# Altium schematic sheet Private_CPU_Power.SchDoc
size D
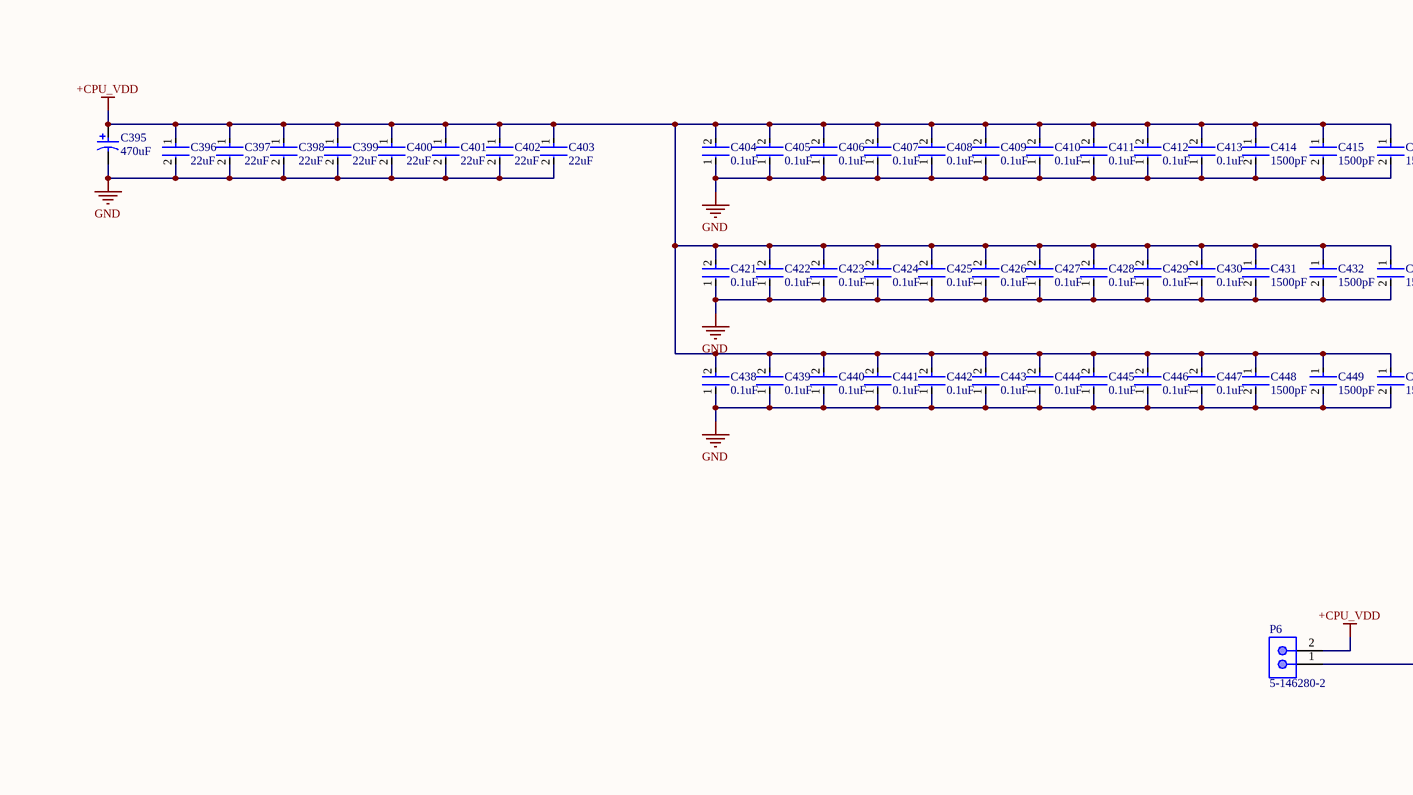
[diagram p0: Private_CPU_Power.SchDoc, top left]
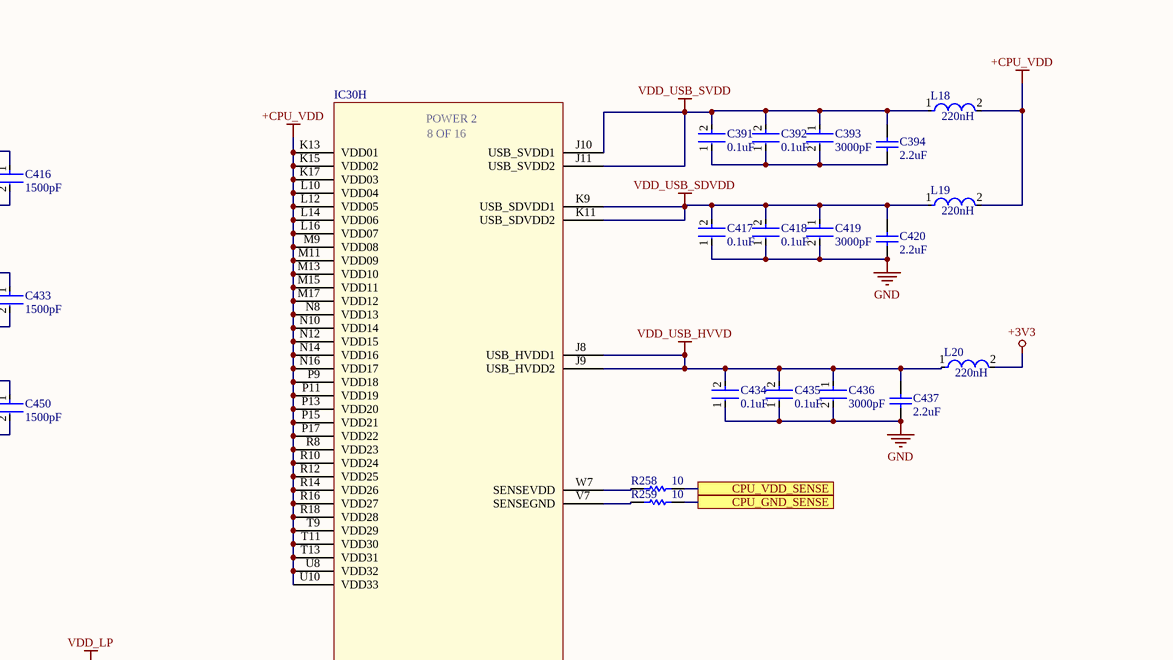
[diagram p1: Private_CPU_Power.SchDoc, top right]
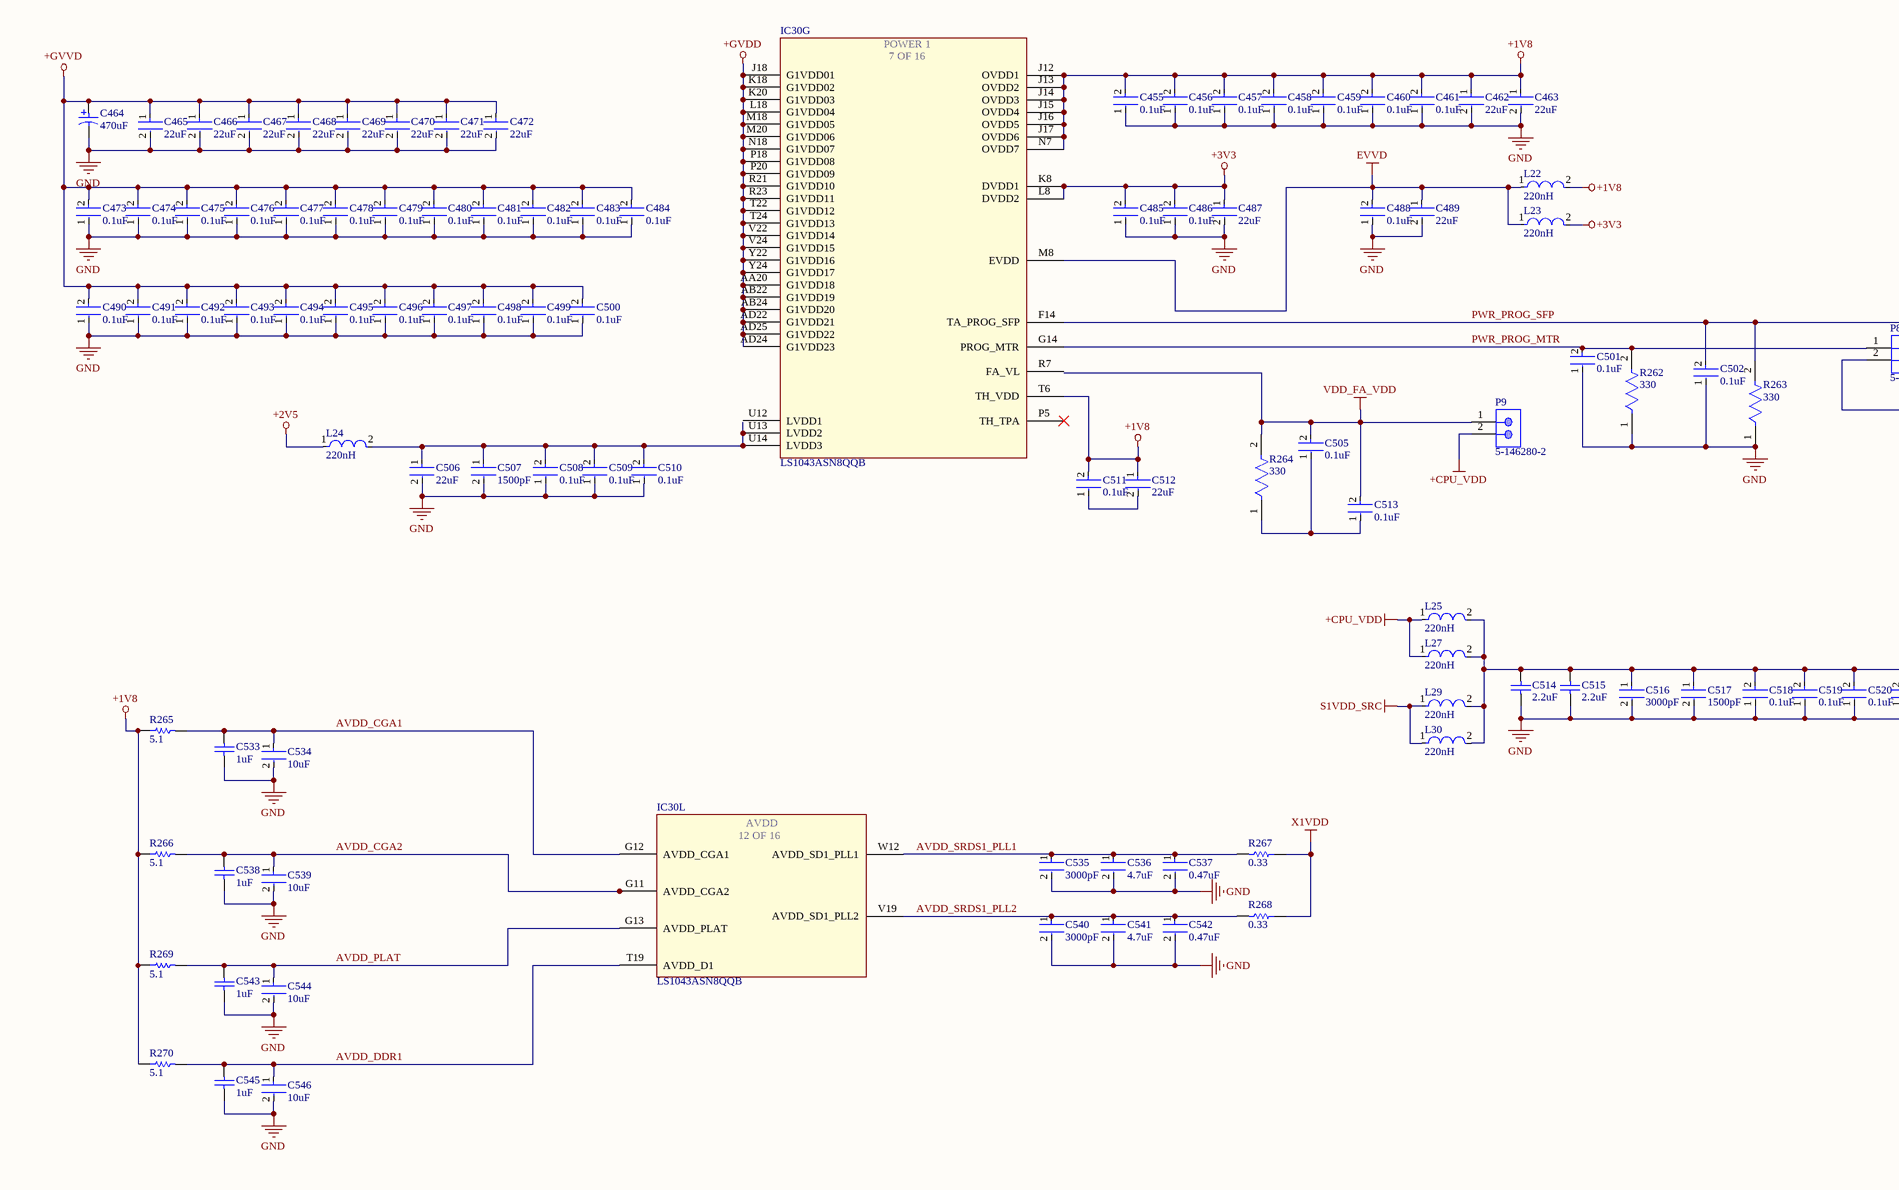
[diagram p2: Private_CPU_Power.SchDoc, bottom left]
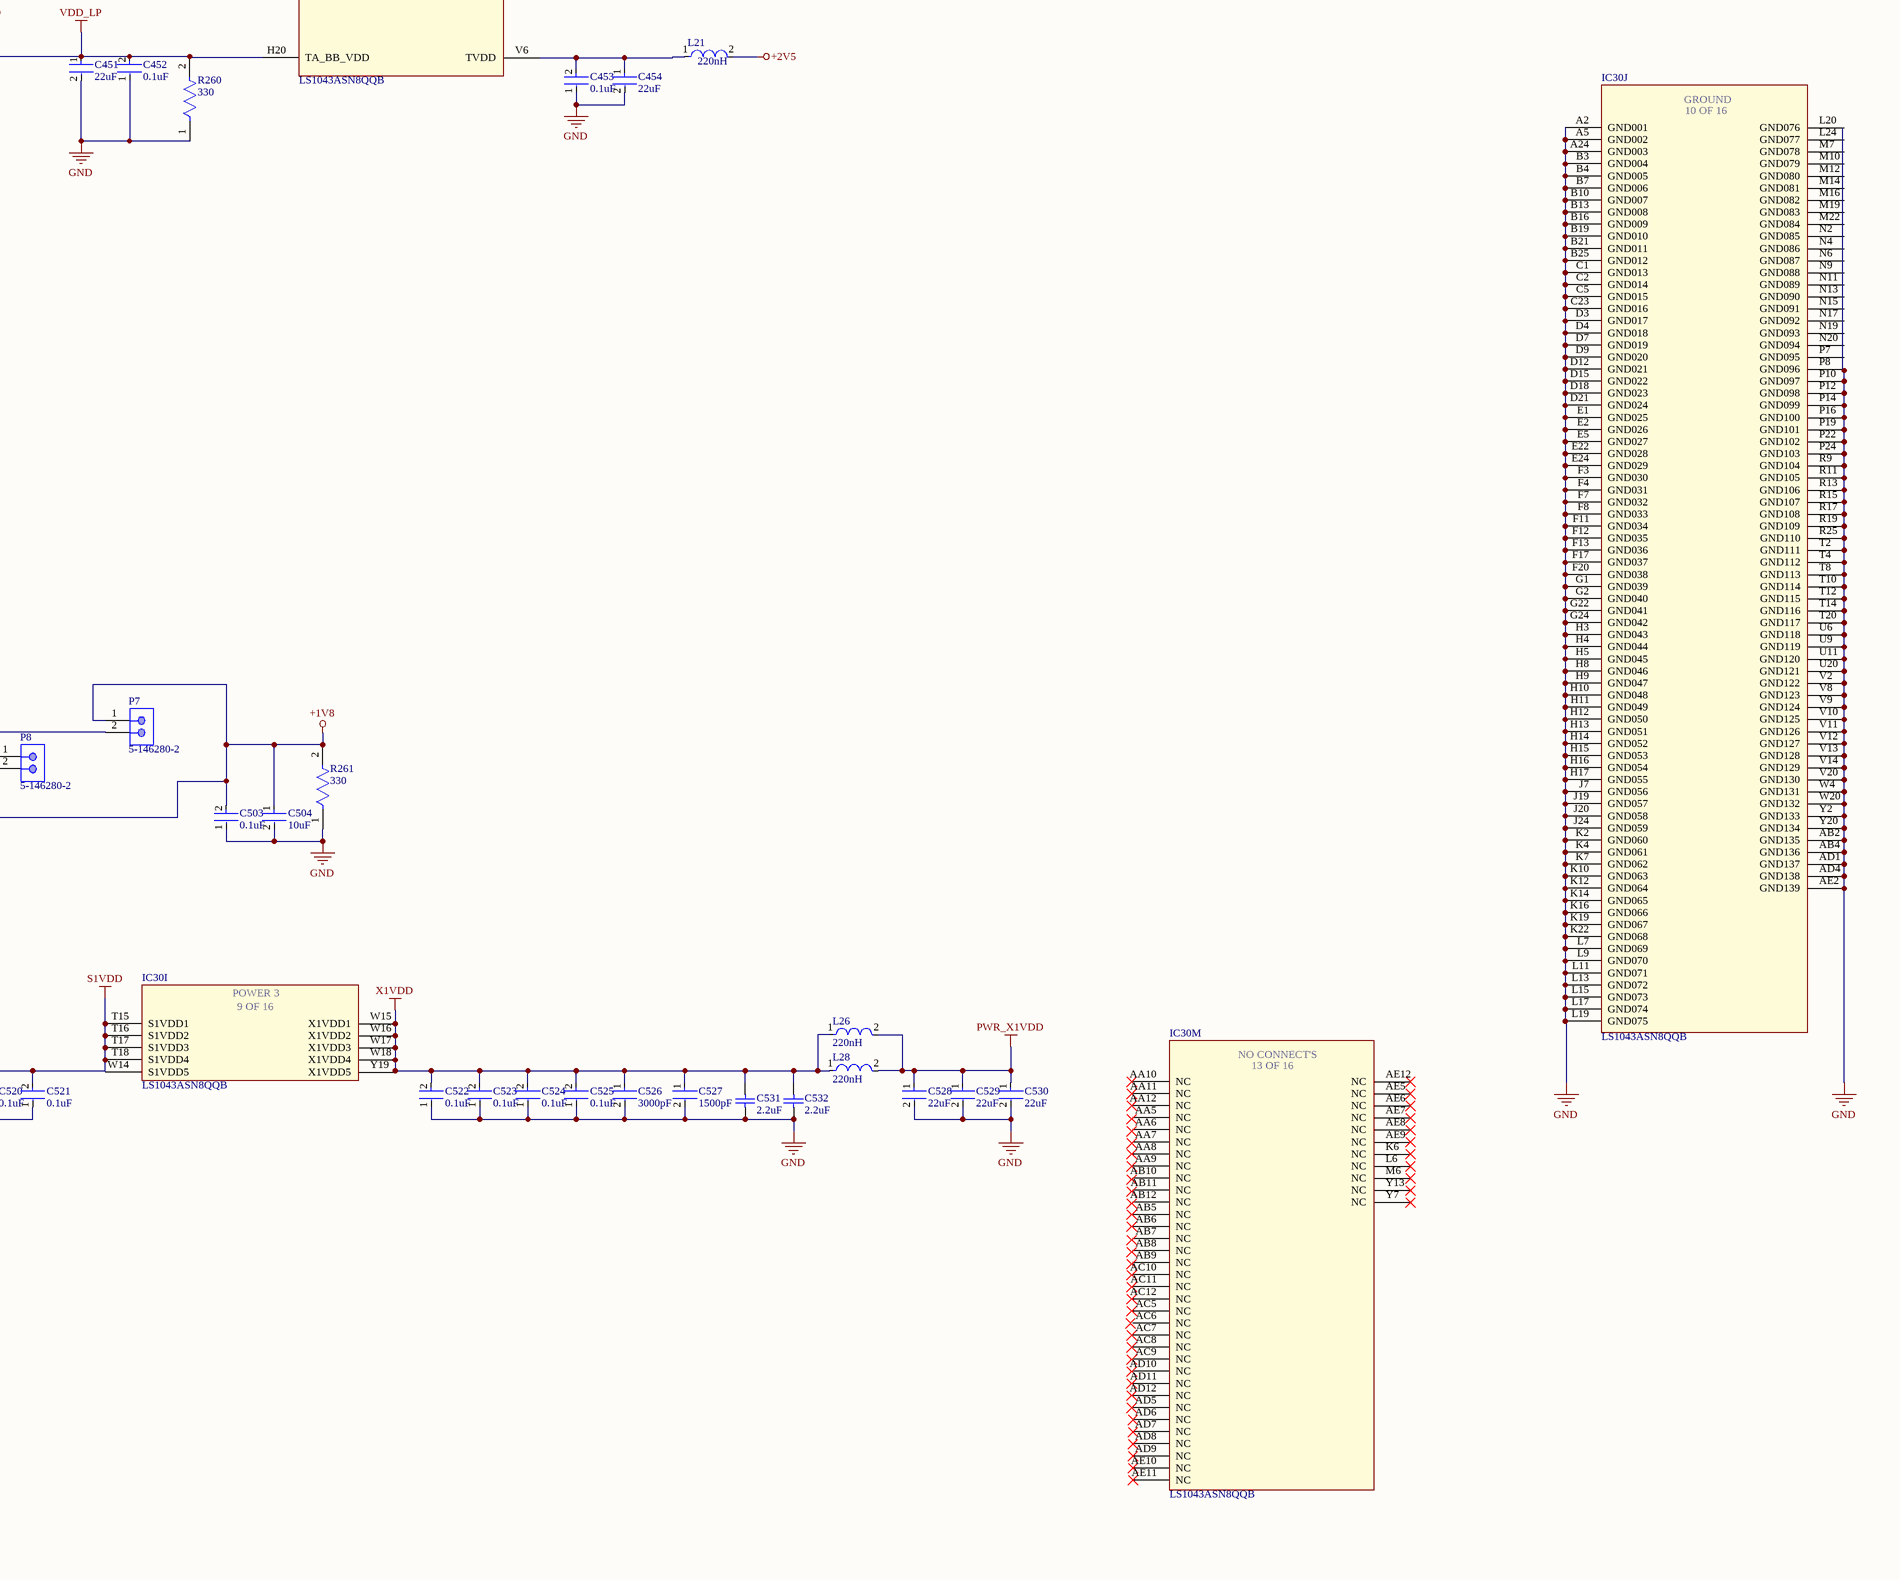
[diagram p3: Private_CPU_Power.SchDoc, bottom right]

## Parts
C391  0.1uF  [FP-GRM15-MFG]
C392  0.1uF  [FP-GRM15-MFG]
C393  3000pF  [FP-GRM155-0_05-IPC_B]
C394  2.2uF  [CAPC1005X55X30NL05T10]
C395  470uF  [PNSC-FK-V-F_V]
C396  22uF  [FP-GRM21B-0_15-MFG]
C397  22uF  [FP-GRM21B-0_15-MFG]
C398  22uF  [FP-GRM21B-0_15-MFG]
C399  22uF  [FP-GRM21B-0_15-MFG]
C400  22uF  [FP-GRM21B-0_15-MFG]
C401  22uF  [FP-GRM21B-0_15-MFG]
C402  22uF  [FP-GRM21B-0_15-MFG]
C403  22uF  [FP-GRM21B-0_15-MFG]
C404  0.1uF  [FP-GRM15-MFG]
C405  0.1uF  [FP-GRM15-MFG]
C406  0.1uF  [FP-GRM15-MFG]
C407  0.1uF  [FP-GRM15-MFG]
C408  0.1uF  [FP-GRM15-MFG]
C409  0.1uF  [FP-GRM15-MFG]
C410  0.1uF  [FP-GRM15-MFG]
C411  0.1uF  [FP-GRM15-MFG]
C412  0.1uF  [FP-GRM15-MFG]
C413  0.1uF  [FP-GRM15-MFG]
C414  1500pF  [FP-C0402-BB-MFG]
C415  1500pF  [FP-C0402-BB-MFG]
C416  1500pF  [FP-C0402-BB-MFG]
C417  0.1uF  [FP-GRM15-MFG]
C418  0.1uF  [FP-GRM15-MFG]
C419  3000pF  [FP-GRM155-0_05-IPC_B]
C420  2.2uF  [CAPC1005X55X30NL05T10]
C421  0.1uF  [FP-GRM15-MFG]
C422  0.1uF  [FP-GRM15-MFG]
C423  0.1uF  [FP-GRM15-MFG]
C424  0.1uF  [FP-GRM15-MFG]
C425  0.1uF  [FP-GRM15-MFG]
C426  0.1uF  [FP-GRM15-MFG]
C427  0.1uF  [FP-GRM15-MFG]
C428  0.1uF  [FP-GRM15-MFG]
C429  0.1uF  [FP-GRM15-MFG]
C430  0.1uF  [FP-GRM15-MFG]
C431  1500pF  [FP-C0402-BB-MFG]
C432  1500pF  [FP-C0402-BB-MFG]
C433  1500pF  [FP-C0402-BB-MFG]
C434  0.1uF  [FP-GRM15-MFG]
C435  0.1uF  [FP-GRM15-MFG]
C436  3000pF  [FP-GRM155-0_05-IPC_B]
C437  2.2uF  [CAPC1005X55X30NL05T10]
C438  0.1uF  [FP-GRM15-MFG]
C439  0.1uF  [FP-GRM15-MFG]
C440  0.1uF  [FP-GRM15-MFG]
C441  0.1uF  [FP-GRM15-MFG]
C442  0.1uF  [FP-GRM15-MFG]
C443  0.1uF  [FP-GRM15-MFG]
C444  0.1uF  [FP-GRM15-MFG]
C445  0.1uF  [FP-GRM15-MFG]
C446  0.1uF  [FP-GRM15-MFG]
C447  0.1uF  [FP-GRM15-MFG]
C448  1500pF  [FP-C0402-BB-MFG]
C449  1500pF  [FP-C0402-BB-MFG]
C450  1500pF  [FP-C0402-BB-MFG]
C451  22uF  [FP-GRM21B-0_15-MFG]
C452  0.1uF  [FP-GRM15-MFG]
C453  0.1uF  [FP-GRM15-MFG]
C454  22uF  [FP-GRM21B-0_15-MFG]
C455  0.1uF  [FP-GRM15-MFG]
C456  0.1uF  [FP-GRM15-MFG]
C457  0.1uF  [FP-GRM15-MFG]
C458  0.1uF  [FP-GRM15-MFG]
C459  0.1uF  [FP-GRM15-MFG]
C460  0.1uF  [FP-GRM15-MFG]
C461  0.1uF  [FP-GRM15-MFG]
C462  22uF  [FP-GRM21B-0_15-MFG]
C463  22uF  [FP-GRM21B-0_15-MFG]
C464  470uF  [PNSC-FK-V-F_V]
C465  22uF  [FP-GRM21B-0_15-MFG]
C466  22uF  [FP-GRM21B-0_15-MFG]
C467  22uF  [FP-GRM21B-0_15-MFG]
C468  22uF  [FP-GRM21B-0_15-MFG]
C469  22uF  [FP-GRM21B-0_15-MFG]
C470  22uF  [FP-GRM21B-0_15-MFG]
C471  22uF  [FP-GRM21B-0_15-MFG]
C472  22uF  [FP-GRM21B-0_15-MFG]
C473  0.1uF  [FP-GRM15-MFG]
C474  0.1uF  [FP-GRM15-MFG]
C475  0.1uF  [FP-GRM15-MFG]
C476  0.1uF  [FP-GRM15-MFG]
C477  0.1uF  [FP-GRM15-MFG]
C478  0.1uF  [FP-GRM15-MFG]
C479  0.1uF  [FP-GRM15-MFG]
C480  0.1uF  [FP-GRM15-MFG]
C481  0.1uF  [FP-GRM15-MFG]
C482  0.1uF  [FP-GRM15-MFG]
C483  0.1uF  [FP-GRM15-MFG]
C484  0.1uF  [FP-GRM15-MFG]
C485  0.1uF  [FP-GRM15-MFG]
C486  0.1uF  [FP-GRM15-MFG]
C487  22uF  [FP-GRM21B-0_15-MFG]
C488  0.1uF  [FP-GRM15-MFG]
C489  22uF  [FP-GRM21B-0_15-MFG]
C490  0.1uF  [FP-GRM15-MFG]
C491  0.1uF  [FP-GRM15-MFG]
C492  0.1uF  [FP-GRM15-MFG]
C493  0.1uF  [FP-GRM15-MFG]
C494  0.1uF  [FP-GRM15-MFG]
C495  0.1uF  [FP-GRM15-MFG]
C496  0.1uF  [FP-GRM15-MFG]
C497  0.1uF  [FP-GRM15-MFG]
C498  0.1uF  [FP-GRM15-MFG]
C499  0.1uF  [FP-GRM15-MFG]
C500  0.1uF  [FP-GRM15-MFG]
C501  0.1uF  [FP-GRM15-MFG]
C502  0.1uF  [FP-GRM15-MFG]
C503  0.1uF  [FP-GRM15-MFG]
C504  10uF  [FP-C0805C-DG-MFG]
C505  0.1uF  [FP-GRM15-MFG]
C506  22uF  [FP-GRM21B-0_15-MFG]
C507  1500pF  [FP-C0402-BB-MFG]
C508  0.1uF  [FP-GRM15-MFG]
C509  0.1uF  [FP-GRM15-MFG]
C510  0.1uF  [FP-GRM15-MFG]
C511  0.1uF  [FP-GRM15-MFG]
C512  22uF  [FP-GRM21B-0_15-MFG]
C513  0.1uF  [FP-GRM15-MFG]
C514  2.2uF  [CAPC1005X55X30NL05T10]
C515  2.2uF  [CAPC1005X55X30NL05T10]
C516  3000pF  [FP-GRM155-0_05-IPC_B]
C517  1500pF  [FP-C0402-BB-MFG]
C518  0.1uF  [FP-GRM15-MFG]
C519  0.1uF  [FP-GRM15-MFG]
C520  0.1uF  [FP-GRM15-MFG]
C521  0.1uF  [FP-GRM15-MFG]
C522  0.1uF  [FP-GRM15-MFG]
C523  0.1uF  [FP-GRM15-MFG]
C524  0.1uF  [FP-GRM15-MFG]
C525  0.1uF  [FP-GRM15-MFG]
C526  3000pF  [FP-GRM155-0_05-IPC_B]
C527  1500pF  [FP-C0402-BB-MFG]
C528  22uF  [FP-GRM21B-0_15-MFG]
C529  22uF  [FP-GRM21B-0_15-MFG]
C530  22uF  [FP-GRM21B-0_15-MFG]
C531  2.2uF  [CAPC1005X55X30NL05T10]
C532  2.2uF  [CAPC1005X55X30NL05T10]
C533  1uF  [CAPC1005X60X30LL05T10]
C534  10uF  [FP-C0805C-DG-MFG]
C535  3000pF  [FP-GRM155-0_05-IPC_B]
C536  4.7uF  [FP-GRM188-0_2-IPC_C]
C537  0.47uF  [FP-GRM188-0_1-e0_2_0_5-IPC_B]
C538  1uF  [CAPC1005X60X30LL05T10]
C539  10uF  [FP-C0805C-DG-MFG]
C540  3000pF  [FP-GRM155-0_05-IPC_B]
C541  4.7uF  [FP-GRM188-0_2-IPC_C]
C542  0.47uF  [FP-GRM188-0_1-e0_2_0_5-IPC_B]
C543  1uF  [CAPC1005X60X30LL05T10]
C544  10uF  [FP-C0805C-DG-MFG]
C545  1uF  [CAPC1005X60X30LL05T10]
C546  10uF  [FP-C0805C-DG-MFG]
IC30  LS1043ASN8QQB  [BGA780C80P28X28_2300X2300X261]  (parts G,H,I,J,L,M of 16)
L18  220nH  [FP-MPLCG0530-MFG]
L19  220nH  [FP-MPLCG0530-MFG]
L20  220nH  [FP-MPLCG0530-MFG]
L21  220nH  [FP-MPLCG0530-MFG]
L22  220nH  [FP-MPLCG0530-MFG]
L23  220nH  [FP-MPLCG0530-MFG]
L24  220nH  [FP-MPLCG0530-MFG]
L25  220nH  [FP-MPLCG0530-MFG]
L26  220nH  [FP-MPLCG0530-MFG]
L27  220nH  [FP-MPLCG0530-MFG]
L28  220nH  [FP-MPLCG0530-MFG]
L29  220nH  [FP-MPLCG0530-MFG]
L30  220nH  [FP-MPLCG0530-MFG]
P6  5-146280-2  [TECO-5-146280-2_V]
P7  5-146280-2  [TECO-5-146280-2_V]
P8  5-146280-2  [TECO-5-146280-2_V]
P9  5-146280-2  [TECO-5-146280-2_V]
R258  10  [RESC1005X40X25NL05T05]
R259  10  [RESC1005X40X25NL05T05]
R260  330  [FP-CRCW0402-e3-MFG]
R261  330  [FP-CRCW0402-e3-MFG]
R262  330  [FP-CRCW0402-e3-MFG]
R263  330  [FP-CRCW0402-e3-MFG]
R264  330  [FP-CRCW0402-e3-MFG]
R265  5.1  [RESC1005X40X25LL05T05]
R266  5.1  [RESC1005X40X25LL05T05]
R267  0.33  [RESC2013X50X40LL20T20]
R268  0.33  [RESC2013X50X40LL20T20]
R269  5.1  [RESC1005X40X25LL05T05]
R270  5.1  [RESC1005X40X25LL05T05]

## Ports
CPU_GND_SENSE, CPU_VDD_SENSE

## Nets
+1V8: C455.2 C456.2 C457.2 C458.2 C459.2 C460.2 C461.2 C462.1 C463.1 C503.2 C504.1 C511.2 C512.1 IC30.J12(OVDD1) IC30.J13(OVDD2) IC30.J14(OVDD3) IC30.J15(OVDD4) IC30.J16(OVDD5) IC30.J17(OVDD6) IC30.N7(OVDD7) IC30.T6(TH_VDD) L22.2 P7.1 P8.2 R261.2 R265.1 R266.1 R269.1 R270.1
+2V5: L21.2 L24.1
+3V3: C485.2 C486.2 C487.1 IC30.K8(DVDD1) IC30.L8(DVDD2) L20.2 L23.2
+CPU_VDD: C395.1 C396.1 C397.1 C398.1 C399.1 C400.1 C401.1 C402.1 C403.1 C404.2 C405.2 C406.2 C407.2 C408.2 C409.2 C410.2 C411.2 C412.2 C413.2 C414.1 C415.1 C416.1 C421.2 C422.2 C423.2 C424.2 C425.2 C426.2 C427.2 C428.2 C429.2 C430.2 C431.1 C432.1 C433.1 C438.2 C439.2 C440.2 C441.2 C442.2 C443.2 C444.2 C445.2 C446.2 C447.2 C448.1 C449.1 C450.1 IC30.K13(VDD01) IC30.K15(VDD02) IC30.K17(VDD03) IC30.L10(VDD04) IC30.L12(VDD05) IC30.L14(VDD06) IC30.L16(VDD07) IC30.M9(VDD08) IC30.M11(VDD09) IC30.M13(VDD10) IC30.M15(VDD11) IC30.M17(VDD12) IC30.N8(VDD13) IC30.N10(VDD14) IC30.N12(VDD15) IC30.N14(VDD16) IC30.N16(VDD17) IC30.P9(VDD18) IC30.P11(VDD19) IC30.P13(VDD20) IC30.P15(VDD21) IC30.P17(VDD22) IC30.R8(VDD23) IC30.R10(VDD24) IC30.R12(VDD25) IC30.R14(VDD26) IC30.R16(VDD27) IC30.R18(VDD28) IC30.T9(VDD29) IC30.T11(VDD30) IC30.T13(VDD31) IC30.U8(VDD32) IC30.U10(VDD33) L18.2 L19.2 L25.1 L27.1 P6.2 P9.2
+GVDD: IC30.AA20(G1VDD18) IC30.AB22(G1VDD19) IC30.AB24(G1VDD20) IC30.AD22(G1VDD21) IC30.AD24(G1VDD23) IC30.AD25(G1VDD22) IC30.J18(G1VDD01) IC30.K18(G1VDD02) IC30.K20(G1VDD03) IC30.L18(G1VDD04) IC30.M18(G1VDD05) IC30.M20(G1VDD06) IC30.N18(G1VDD07) IC30.P18(G1VDD08) IC30.P20(G1VDD09) IC30.R21(G1VDD10) IC30.R23(G1VDD11) IC30.T22(G1VDD12) IC30.T24(G1VDD13) IC30.V22(G1VDD14) IC30.V24(G1VDD15) IC30.Y22(G1VDD16) IC30.Y24(G1VDD17)
+GVVD: C464.1 C465.1 C466.1 C467.1 C468.1 C469.1 C470.1 C471.1 C472.1 C473.2 C474.2 C475.2 C476.2 C477.2 C478.2 C479.2 C480.2 C481.2 C482.2 C483.2 C484.2 C490.2 C491.2 C492.2 C493.2 C494.2 C495.2 C496.2 C497.2 C498.2 C499.2 C500.2
EVVD: C488.2 C489.1 IC30.M8(EVDD) L22.1 L23.1
GND: C395.2 C396.2 C397.2 C398.2 C399.2 C400.2 C401.2 C402.2 C403.2 C404.1 C405.1 C406.1 C407.1 C408.1 C409.1 C410.1 C411.1 C412.1 C413.1 C414.2 C415.2 C416.2 C417.1 C418.1 C419.2 C420.1 C421.1 C422.1 C423.1 C424.1 C425.1 C426.1 C427.1 C428.1 C429.1 C430.1 C431.2 C432.2 C433.2 C434.1 C435.1 C436.2 C437.1 C438.1 C439.1 C440.1 C441.1 C442.1 C443.1 C444.1 C445.1 C446.1 C447.1 C448.2 C449.2 C450.2 C451.2 C452.1 C453.1 C454.2 C455.1 C456.1 C457.1 C458.1 C459.1 C460.1 C461.1 C462.2 C463.2 C464.2 C465.2 C466.2 C467.2 C468.2 C469.2 C470.2 C471.2 C472.2 C473.1 C474.1 C475.1 C476.1 C477.1 C478.1 C479.1 C480.1 C481.1 C482.1 C483.1 C484.1 C485.1 C486.1 C487.2 C488.1 C489.2 C490.1 C491.1 C492.1 C493.1 C494.1 C495.1 C496.1 C497.1 C498.1 C499.1 C500.1 C501.1 C502.1 C503.1 C504.2 C506.2 C507.2 C508.1 C509.1 C510.1 C514.1 C515.1 C516.2 C517.2 C518.1 C519.1 C520.1 C521.1 C522.1 C523.1 C524.1 C525.1 C526.2 C527.2 C528.2 C529.2 C530.2 C531.1 C532.1 C533.1 C534.2 C535.2 C536.2 C537.2 C538.1 C539.2 C540.2 C541.2 C542.2 C543.1 C544.2 C545.1 C546.2 IC30.A2(GND001) IC30.A5(GND002) IC30.A24(GND003) IC30.AB2(GND135) IC30.AB4(GND136) IC30.AD1(GND137) IC30.AD4(GND138) IC30.AE2(GND139) IC30.B3(GND004) IC30.B4(GND005) IC30.B7(GND006) IC30.B10(GND007) IC30.B13(GND008) IC30.B16(GND009) IC30.B19(GND010) IC30.B21(GND011) IC30.B25(GND012) IC30.C1(GND013) IC30.C2(GND014) IC30.C5(GND015) IC30.C23(GND016) IC30.D3(GND017) IC30.D4(GND018) IC30.D7(GND019) IC30.D9(GND020) IC30.D12(GND021) IC30.D15(GND022) IC30.D18(GND023) IC30.D21(GND024) IC30.E1(GND025) IC30.E2(GND026) IC30.E5(GND027) IC30.E22(GND028) IC30.E24(GND029) IC30.F3(GND030) IC30.F4(GND031) IC30.F7(GND032) IC30.F8(GND033) IC30.F11(GND034) IC30.F12(GND035) IC30.F13(GND036) IC30.F17(GND037) IC30.F20(GND038) IC30.G1(GND039) IC30.G2(GND040) IC30.G22(GND041) IC30.G24(GND042) IC30.H3(GND043) IC30.H4(GND044) IC30.H5(GND045) IC30.H8(GND046) IC30.H9(GND047) IC30.H10(GND048) IC30.H11(GND049) IC30.H12(GND050) IC30.H13(GND051) IC30.H14(GND052) IC30.H15(GND053) IC30.H16(GND054) IC30.H17(GND055) IC30.J7(GND056) IC30.J19(GND057) IC30.J20(GND058) IC30.J24(GND059) IC30.K2(GND060) IC30.K4(GND061) IC30.K7(GND062) IC30.K10(GND063) IC30.K12(GND064) IC30.K14(GND065) IC30.K16(GND066) IC30.K19(GND067) IC30.K22(GND068) IC30.L7(GND069) IC30.L9(GND070) IC30.L11(GND071) IC30.L13(GND072) IC30.L15(GND073) IC30.L17(GND074) IC30.L19(GND075) IC30.P8(GND096) IC30.P10(GND097) IC30.P12(GND098) IC30.P14(GND099) IC30.P16(GND100) IC30.P19(GND101) IC30.P22(GND102) IC30.P24(GND103) IC30.R9(GND104) IC30.R11(GND105) IC30.R13(GND106) IC30.R15(GND107) IC30.R17(GND108) IC30.R19(GND109) IC30.R25(GND110) IC30.T2(GND111) IC30.T4(GND112) IC30.T8(GND113) IC30.T10(GND114) IC30.T12(GND115) IC30.T14(GND116) IC30.T20(GND117) IC30.U6(GND118) IC30.U9(GND119) IC30.U11(GND120) IC30.U20(GND121) IC30.V2(GND122) IC30.V8(GND123) IC30.V9(GND124) IC30.V10(GND125) IC30.V11(GND126) IC30.V12(GND127) IC30.V13(GND128) IC30.V14(GND129) IC30.V20(GND130) IC30.W4(GND131) IC30.W20(GND132) IC30.Y2(GND133) IC30.Y20(GND134) R260.1 R261.1 R262.1 R263.1
PWR_X1VDD: C528.1 C529.1 C530.1 L26.2 L28.2
S1VDD: C514.2 C515.2 C516.1 C517.1 C518.2 C519.2 C520.2 C521.2 IC30.T15(S1VDD1) IC30.T16(S1VDD2) IC30.T17(S1VDD3) IC30.T18(S1VDD4) L25.2 L27.2 L29.2 L30.2
S1VDD_SRC: L29.1 L30.1
VDD_FA_VDD: C505.2 C513.2 P9.1 R264.2
VDD_LP: C451.1 C452.2 IC30.H20(TA_BB_VDD) P6.1 R260.2
VDD_USB_HVVD: C434.2 C435.2 C436.1 C437.2 IC30.J8(USB_HVDD1) IC30.J9(USB_HVDD2) L20.1
VDD_USB_SDVDD: C417.2 C418.2 C419.1 C420.2 IC30.K9(USB_SDVDD1) IC30.K11(USB_SDVDD2) L19.1
VDD_USB_SVDD: C391.2 C392.2 C393.1 C394.2 IC30.J10(USB_SVDD1) IC30.J11(USB_SVDD2) L18.1
X1VDD: C522.2 C523.2 C524.2 C525.2 C526.1 C527.1 C531.2 C532.2 IC30.W15(X1VDD1) IC30.W16(X1VDD2) IC30.W17(X1VDD3) IC30.W18(X1VDD4) IC30.Y19(X1VDD5) L26.1 L28.1 R267.1 R268.1
AVDD_CGA1: C533.2 C534.1 IC30.G12(AVDD_CGA1) R265.2
AVDD_CGA2: C538.2 C539.1 IC30.G11(AVDD_CGA2) R266.2
AVDD_DDR1: C545.2 C546.1 IC30.T19(AVDD_D1) R270.2
AVDD_PLAT: C543.2 C544.1 IC30.G13(AVDD_PLAT) R269.2
AVDD_SRDS1_PLL1: C535.1 C536.1 C537.1 IC30.W12(AVDD_SD1_PLL1) R267.2
AVDD_SRDS1_PLL2: C540.1 C541.1 C542.1 IC30.V19(AVDD_SD1_PLL2) R268.2
CPU_GND_SENSE: R259.2 ; port CPU_GND_SENSE
CPU_VDD_SENSE: R258.2 ; port CPU_VDD_SENSE
PWR_PROG_MTR: C501.2 IC30.G14(PROG_MTR) P8.1 R262.2
PWR_PROG_SFP: C502.2 IC30.F14(TA_PROG_SFP) P7.2 R263.2
NetC391_1: C391.1 C392.1 C393.2 C394.1
NetC453_2: C453.2 C454.1 IC30.V6(TVDD) L21.1
NetC505_1: C505.1 C513.1 R264.1
NetC506_1: C506.1 C507.1 C508.2 C509.2 C510.2 IC30.U13(LVDD2) IC30.U14(LVDD3) L24.2
NetC511_1: C511.1 C512.2
NetIC30_V7: IC30.V7(SENSEGND) R259.1
NetIC30_W7: IC30.W7(SENSEVDD) R258.1

Not connected (* = marked no-connect by the designer): IC30 AA5(NC) AA6(NC) AA7(NC) AA8(NC) AA9(NC) AA10(NC) AA11(NC) AA12(NC) AB5(NC) AB6(NC) AB7(NC) AB8(NC) AB9(NC) AB10(NC) AB11(NC) AB12(NC) AC5(NC) AC6(NC) AC7(NC) AC8(NC) AC9(NC) AC10(NC) AC11(NC) AC12(NC) AD5(NC) AD6(NC)* AD7(NC)* AD8(NC)* AD9(NC)* AD10(NC) AD11(NC) AD12(NC) AE5(NC)* AE6(NC)* AE7(NC)* AE8(NC)* AE9(NC)* AE10(NC)* AE11(NC)* AE12(NC)* K6(NC)* L6(NC)* L20(GND076) L24(GND077) M6(NC)* M7(GND078) M10(GND079) M12(GND080) M14(GND081) M16(GND082) M19(GND083) M22(GND084) N2(GND085) N4(GND086) N6(GND087) N9(GND088) N11(GND089) N13(GND090) N15(GND091) N17(GND092) N19(GND093) N20(GND094) P5(TH_TPA)* P7(GND095) R7(FA_VL) U12(LVDD1) W14(S1VDD5) Y7(NC)* Y13(NC)*

## Notes on the sheet
- Title
- Size:
- Date:
- File:
- D
- Number:
- Time:
- Revision:
- Sheet
- of
- (in symbol LS1043ASN8QQB, part G) POWER 1; 7 OF 16
- (in symbol LS1043ASN8QQB, part H) POWER 2; 8 OF 16
- (in symbol LS1043ASN8QQB, part I) POWER 3; 9 OF 16
- (in symbol LS1043ASN8QQB, part J) GROUND; 10 OF 16
- (in symbol LS1043ASN8QQB, part L) AVDD; 12 OF 16
- (in symbol LS1043ASN8QQB, part M) NO CONNECT'S; 13 OF 16

## Library data of the parts
C391 C392 C404-C413 C417 C418 C421-C430 C434 C435 C438-C447 C452 C453 C455-C461 C473-C486 C488 C490-C503 C505 C508-C511 C513 C518-C525 = CMP-2100-03641-2: CAP CER 0.1UF 16V X7R 0402; Manufacturer Part Number: GRM155R71C104KA88D; Manufacturer: Murata; Standoff Height: 0mm; Tolerance: 10%; Voltage Rating: 16Vdc; Material: Ceramic; Capacitance: 0.10μF; Value: 0.10μF; RoHS: TRUE; Temperature Characteristic: X7R; Octopart: https://octopart.com/grm155r71c104ka88d-murata-196880; Digikey Description: CAP CER 0.1UF 16V X7R 0402; Device Class L3: Ceramic Capacitors; Height: 0.55mm; ComponentLink2Description: Datasheet; Temperature Range Low: -55°C; Ipc Land Pattern Name: CAPC10050X219; ComponentLink2URL: https://search.murata.co.jp/Ceramy/image/img/A01X/G101/ENG/GRM155R71H471KA01-01A.pdf; Device Class L1: Passive Components; Lead Free: yes; Category: Cap; Package: GRM15; Temperature: -55°C to +125°C; Device Class L2: Capacitors; Temperature Range High: +125°C; Mouser Description: 0402 0.1 uF 16V ±10 % Tolerance X7R SMT Multilayer Ceramic Capacitor
C393 C419 C436 C516 C526 C535 C540 = CMP-2008-04488-2: Chip Multilayer Ceramic Capacitors for General Purpose, 0402, 3000pF, U2J, -750ppm/°C, 5%, 10V; Capacitance: 3nF; Termination: SMD/SMT; Case Code (Imperial): 0402; Radiation Hardening: No; Mount: Surface Mount; Tolerance: 5%; Packaging: Tape and Reel; Thickness: 0.022inch; Max Operating Temperature: 125°C; Length: 1mm; Min Operating Temperature: -55°C; Voltage Rating (DC): 10V; Dielectric: U2J; Depth: 0.5mm; Lead Free: Lead Free; Width: 0.5mm; Package Quantity: 10000; Height: 0.5mm; Case Code (Metric): 1005; Voltage Rating: 10V; Case/Package: 0402
C394 C420 C437 C514 C515 C531 C532 = CMP-2008-02064-2: Manufacturer: Kemet; Part Number: C0402C225M9PACTU
C395 C464 = CMP-2000-06204-1: Aluminum Electrolytic Capacitor, 470 uF, +/- 20%, 16 V, 2-Pin SMD (Size Code F), -55 to 105 degC, RoHS, Tape and Reel; Manufacturer: Panasonic; Capacitance: 470µF; Type: Can; Ripple Current: 600mA; Lifetime@Temperature: 2000Hrs@105°C; Impedance: 0.16O; Rated Voltage: 16V; Manufacturer URL: http://www.panasonic.com/; Package Description: 2-Pin Electrolytic Aluminum Capacitor, Body 8.3 x 8.3 mm; Operating Temp-Max: 105°C; Mounting Technology: SurfaceMount; Operating Temp Range: -55to+105°C; Datasheet Version: 03/2016; Series: FK; Package Reference: FK-V-F; Case Size/Dimension: Ø8x10.2mm; Package URL: http://industrial.panasonic.com/cdbs/www-data/pdf/RDE0000/DME0000COL48.pdf; Datasheet URL: http://industrial.panasonic.com/cdbs/www-data/pdf/RDE0000/ABA0000C1181.pdf
C396-C403 C451 C454 C462 C463 C465-C472 C487 C489 C506 C512 C528-C530 = CMP-2007-03385-2: Chip Multilayer Ceramic Capacitors for General Purpose, 0805, 22uF, X5R, 15%, 20%, 6.3V; Material: Ceramic; Max Operating Temperature: 85°C; Voltage: 6.3V; Min Operating Temperature: -55°C; Case/Package: 0805; Thickness: 0.053inch; Dielectric: X5R; Packaging: Tape and Reel; Depth: 1.25mm; Termination: SMD/SMT; Voltage Rating (DC): 6.3V; Radiation Hardening: No; Tolerance: 20%; Mount: Surface Mount; Lead Free: Lead Free; Package Quantity: 1; REACH SVHC: No SVHC; Voltage Rating: 6.3V; Capacitance: 22uF; Length: 2mm; Case Code (Imperial): 0805; Case Code (Metric): 2012; Width: 0.049inch; Height: 1.25mm
C414-C416 C431-C433 C448-C450 C507 C517 C527 = CMP-2008-03108-2: CAP CER 1500PF 50V X7R 0402; Manufacturer Part Number: C0402C152K5RACTU; Manufacturer: Kemet; Value: 1,500 pF; Material: Ceramic; Tolerance: 0.1; Temperature Coefficient: 15%; Automotive: No; Octopart: https://octopart.com/c0402c152k5ractu-kemet-125298; Device Class L3: Ceramic Capacitors; Device Class L2: Capacitors; Mouser Description: Multilayer Ceramic Capacitors MLCC - SMD/SMT 50volts 1500pF X7R 10%; Temperature Range High: +125°C; ComponentLink2URL: https://content.kemet.com/datasheets/KEM_C1002_X7R_SMD.pdf; ComponentLink2Description: Datasheet; RoHS: TRUE; Temperature: -55°C to +125°C; Height: 0.55mm; Device Class L1: Passive Components; Voltage Rating: 50 V; Lead Free: Yes; Temperature Characteristic: X7R; Temperature Range Low: -55°C; Capacitance: 1,500 pF; Package: C0402-BB; Category: Cap; Digikey Description: CAP CER 1500PF 50V X7R 0402; Ipc Land Pattern Name: CAPC10050X50
C504 C534 C539 C544 C546 = CMP-2007-03243-2: CAP CER 10UF 10V X5R 0805; Manufacturer Part Number: C0805C106K8PACTU; Manufacturer: Kemet; 3DS Part Number: 220-00001; Tolerance: 10%; Temperature Coefficient: 15%; Material: Ceramic; Device Class L2: Capacitors; Device Class L1: Passive Components; ComponentLink2URL: https://content.kemet.com/datasheets/KEM_C1006_X5R_SMD.pdf; Height: 1.4mm; Lead Free: Yes; Digikey Description: CAP CER 10UF 10V X5R 0805; Octopart: https://octopart.com/c0805c106k8pactu-kemet-98697; Capacitance: 10uF; Value: 10uF; Temperature Range Low: -55°C; Temperature: -55°C to +85°C; Automotive: No; Mouser Description: CAP CER 10UF 10V X5R 0805; Ipc Land Pattern Name: CAPC200125X125; Temperature Range High: +85°C; Voltage: 10V; RoHS: TRUE; Device Class L3: Ceramic Capacitors; ComponentLink2Description: Datasheet; Voltage Rating: 10V; Package: C0805C-DG; Temperature Characteristic: X5R; Category: Cap
C533 C538 C543 C545 = CMP-2008-02081-1: Part Number: C0402C105K8PAC7867; Manufacturer: Kemet
C536 C541 = CMP-2006-02545-2: Chip Multilayer Ceramic Capacitors for General Purpose, 0603, 4.7uF, X5R, 15%, 10%, 35V; Lead Free: Lead Free; Max Operating Temperature: 85°C; Case Code (Imperial): 0603; Capacitance: 4.7uF; Width: 0.8mm; Thickness: 0.031inch; Case Code (Metric): 1608; Min Operating Temperature: -55°C; Voltage Rating (DC): 35V; Dielectric: X5R; Voltage: 35V; Packaging: Tape and Reel; Resistor Type: Ceramic; Weight: 0.000222oz; Mount: Surface Mount; Material: Ceramic; Depth: 0.8mm; Tolerance: 10%; REACH SVHC: No SVHC; Case/Package: 0603; Voltage Rating: 35V; Package Quantity: 4000; Height: 0.8mm; Length: 1.6mm; Termination: SMD/SMT
C537 C542 = CMP-2006-02860-2: Chip Multilayer Ceramic Capacitors for General Purpose, 0603, 0.47uF, X7R, 15%, 10%, 16V; Capacitance: 470nF; Material: Ceramic; Termination: SMD/SMT; Case Code (Imperial): 0603; Height: 0.8mm; Dielectric: X7R; Length: 1.6mm; Packaging: Tape and Reel; Mount: Surface Mount; Thickness: 0.035inch; Voltage Rating (DC): 16V; Case Code (Metric): 1608; REACH SVHC: No SVHC; Depth: 0.8mm; Number of Pins: 2; Max Operating Temperature: 125°C; Min Operating Temperature: -55°C; Width: 0.8mm; Voltage: 16V; Lead Free: Lead Free; Voltage Rating: 16V; Package Quantity: 1; Case/Package: 0603; Tolerance: 10%
IC30 = LS1043ASN8QQB: Integrated Circuit; Manufacturer_Name: NXP; Datasheet Link: http://www.nxp.com/secured/assets/documents/en/data-sheet/LS1088A.pdf; Height: 2.61mm; Manufacturer_Part_Number: LS1043ASN8QQB; Mouser Part Number: 771-LS1043ASN8QQB; Mouser Price/Stock: https://www.mouser.co.uk/ProductDetail/NXP-Semiconductors/LS1043ASN8QQB/?qs=AQlKX63v8RsTATOTx7X0Jg%3D%3D
L18-L30 = CMP-03027-000001-1: FIXED IND 220NH 14.1A 3.7 MOHM; Manufacturer: KEMET; Manufacturer Part Number: MPLCG0530LR22; Shielding: true; Saturation Current: 10.2A; Series Resistance: 3.7mΩ; Value: 0.22uH; Standoff Height: 0.1mm; Core Material: Metal Composite; Tolerance: 20%; Test Frequency: 100kHz; Octopart: https://octopart.com/mplcg0530lr22-kemet-30531716; Composition: Wirewound; Height: 3mm; Device Class L2: Inductors; Rms Current: 14.1A; Digikey Description: FIXED IND 220NH 14.1A 3.7 MOHM; Package: MPLCG0530; ComponentLink2Description: Datasheet; Automotive: No; Inductance: 0.22uH; ComponentLink2URL: https://content.kemet.com/datasheets/KEM_L9005_MPLCG.pdf; Temperature Range High: +125°C; RoHS: TRUE; Device Class L3: Fixed Inductors; Temperature Range Low: -40°C; Category: Ind; Device Class L1: Passive Components; Lead Free: Yes; Mouser Description: Fixed Inductors 0.22uH 20% SMD; Temperature: -40°C to +125°C
P6-P9 = CMP-2000-07492-1: Male Header, Pitch 2.54 mm, 1 x 2 Position, Height 8.21 mm, Tail Length 3.05 mm, -65 to 105 degC, RoHS, Bulk; Manufacturer: TE Connectivity; Mating Connector Lock: No(Without); Number of Positions: 2; Pitch: 2.54mm; PCB Mounting Orientation: Vertical; Keyed: No; Case\/Package: 100; Mating Post Length: 0.23inch; High Temperature Housing: Yes; Max Current Rating: 5A; PCB Thickness: 0.063inch; PCB Mount Retention: Without; Approvals: CSA; Current Rating: 3A; Radiation Hardening: No; Length: 4.67mm; Contact Mating Length: 0.23inch; Connector Type: Header; Number of Rows: 1; Termination Post Length: 0.12inch; Board Standoff: No(Without); Max Operating Temperature: 105degC; Contact Shape: Square; Selectively Loaded: No(Without); Gasket: No(Without); Number of Contacts: 2; Contact Gender: Male; Mating Alignment: No(Without); Manufacturer URL: http://www.te.com/; Datasheet URL: http://www.te.com/commerce/DocumentDelivery/DDEController?Action=showdoc&DocId=Customer+Drawing%7F146280%7FH1%7Fpdf%7FEnglish%7FENG_CD_146280_H1.pdf%7F5-146280-2; Mount: ThroughHole; Orientation: Straight; Packaging: Carton; Package Reference: 5-146280-2; Package Quantity: 500; Stabilizers: No(Without); Row Spacing: 2.54mm; Contact Material: CopperAlloy; Panel Mount Retention: No(Without); Datasheet Version: Rev. H1, 08/2016; Housing Colour: Black; Colour: Black; Package Description: Male Header, Pitch 2.54 mm, 1 x 2 Position, Height 8.21 mm, Tail Length 3.05 mm; Contact Plating: Matte; Housing Material: Polymer; Contact Protection: No(Without); Min Operating Temperature: -65degC; Mounting Technology: ThroughHole; Flammability Rating: UL94V-0; RoHSCompliant: true; Termination: ThroughHole; Depth: 2.34mm; High Speed Serial Data Connector: No
R258 R259 = CMP-2002-08143-1: Part Number: CRCW040210R0FKED; Manufacturer: Vishay Dale
R260-R264 = CMP-2002-08523-2: RES Thick Film, 330Ω, 1%, 0.063W, 100ppm/°C, 0402; Max Power Dissipation: 63mW; Voltage Rating (DC): 50V; Resistance: 330R; Case/Package: 0402; Packaging: Tape and Reel; Width: 0.5mm; Case Code (Metric): 1005; Radiation Hardening: No; Military Standard: Not; Contact Plating: Tin; Temperature Coefficient: 100ppm/°C; Lead Free: Lead Free; Power Rating: 63mW; Voltage Rating: 50V; Tolerance: 1%; Features: Automotive AEC-Q200; Case Code (Imperial): 0402; Composition: Thick Film; Weight: 2.3E-05oz; Package Quantity: 10; Min Operating Temperature: -55°C; Height: 0.35mm; Length: 1mm; Termination: SMD/SMT; Number of Terminations: 2; Depth: 0.5mm; Max Operating Temperature: 155°C
R265 R266 R269 R270 = CMP-1011-00251-2: Part Number: CRCW04025R10FKED; Manufacturer: Vishay Dale
R267 R268 = CMP-2001-03204-1: Manufacturer: Susumu; Part Number: RP2012T-R33-F